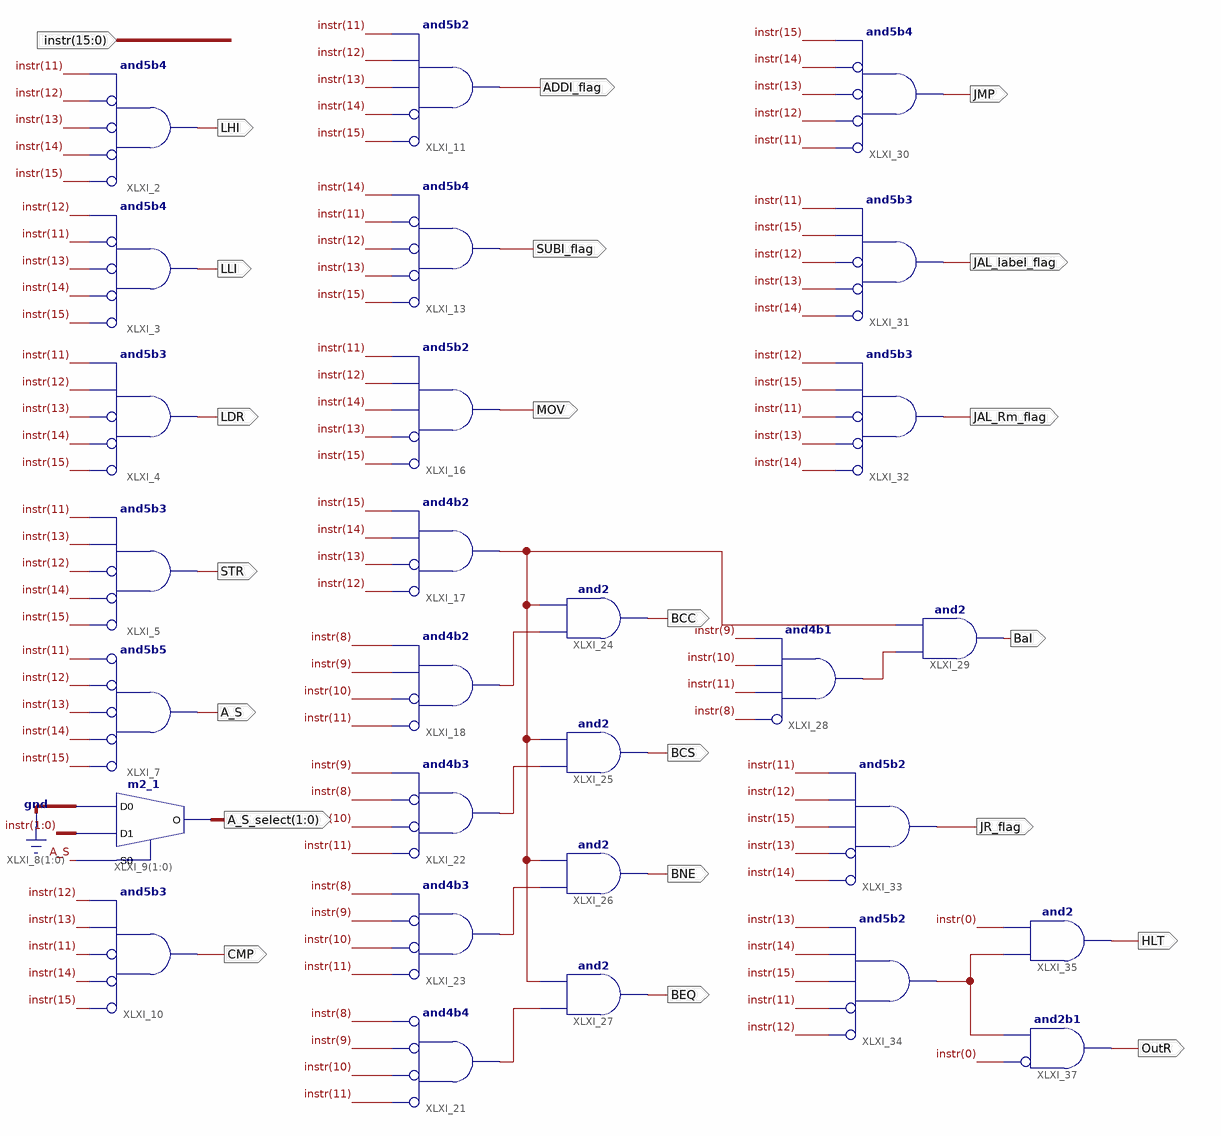
[diagram p0: schematic sheet 1]
// Xilinx ISE schematic ID.sch (artix7) as structural Verilog: 28 symbols, 22 ports
module ID (
  input  [15:0] instr,
  output LHI,
  output LLI,
  output LDR,
  output STR,
  output A_S,
  output [1:0] A_S_select,
  output CMP,
  output ADDI_flag,
  output SUBI_flag,
  output MOV,
  output BCC,
  output BCS,
  output BNE,
  output BEQ,
  output Bal,
  output JMP,
  output JAL_label_flag,
  output JAL_Rm_flag,
  output JR_flag,
  output HLT,
  output OutR
);

  wire XLXN_80, XLXN_98, XLXN_99, XLXN_100, XLXN_101, XLXN_112, XLXN_144;

  and XLXI_2 (LHI, ~instr[15], ~instr[14], ~instr[13], ~instr[12], instr[11]);  // and5b4
  and XLXI_3 (LLI, ~instr[15], ~instr[14], ~instr[13], ~instr[11], instr[12]);  // and5b4
  and XLXI_4 (LDR, ~instr[15], ~instr[14], ~instr[13], instr[12], instr[11]);  // and5b3
  and XLXI_5 (STR, ~instr[15], ~instr[14], ~instr[12], instr[13], instr[11]);  // and5b3
  and XLXI_7 (A_S, ~instr[15], ~instr[14], ~instr[13], ~instr[12], ~instr[11]);  // and5b5
  m2_1 XLXI_9[1:0] (.D0(2'b00), .D1(instr[1:0]), .S0(A_S), .O(A_S_select));
  and XLXI_10 (CMP, ~instr[15], ~instr[14], ~instr[11], instr[13], instr[12]);  // and5b3
  and XLXI_11 (ADDI_flag, ~instr[15], ~instr[14], instr[13], instr[12], instr[11]);  // and5b2
  and XLXI_13 (SUBI_flag, ~instr[15], ~instr[13], ~instr[12], ~instr[11], instr[14]);  // and5b4
  and XLXI_16 (MOV, ~instr[15], ~instr[13], instr[14], instr[12], instr[11]);  // and5b2
  and XLXI_17 (XLXN_80, ~instr[12], ~instr[13], instr[14], instr[15]);  // and4b2
  and XLXI_18 (XLXN_98, ~instr[11], ~instr[10], instr[9], instr[8]);  // and4b2
  and XLXI_21 (XLXN_101, ~instr[11], ~instr[10], ~instr[9], ~instr[8]);  // and4b4
  and XLXI_22 (XLXN_99, ~instr[11], ~instr[10], ~instr[8], instr[9]);  // and4b3
  and XLXI_23 (XLXN_100, ~instr[11], ~instr[10], ~instr[9], instr[8]);  // and4b3
  and XLXI_24 (BCC, XLXN_98, XLXN_80);
  and XLXI_25 (BCS, XLXN_99, XLXN_80);
  and XLXI_26 (BNE, XLXN_100, XLXN_80);
  and XLXI_27 (BEQ, XLXN_101, XLXN_80);
  and XLXI_28 (XLXN_112, ~instr[8], instr[11], instr[10], instr[9]);  // and4b1
  and XLXI_29 (Bal, XLXN_112, XLXN_80);
  and XLXI_30 (JMP, ~instr[11], ~instr[12], ~instr[13], ~instr[14], instr[15]);  // and5b4
  and XLXI_31 (JAL_label_flag, ~instr[14], ~instr[13], ~instr[12], instr[15], instr[11]);  // and5b3
  and XLXI_32 (JAL_Rm_flag, ~instr[14], ~instr[13], ~instr[11], instr[15], instr[12]);  // and5b3
  and XLXI_33 (JR_flag, ~instr[14], ~instr[13], instr[15], instr[12], instr[11]);  // and5b2
  and XLXI_34 (XLXN_144, ~instr[12], ~instr[11], instr[15], instr[14], instr[13]);  // and5b2
  and XLXI_35 (HLT, XLXN_144, instr[0]);
  and XLXI_37 (OutR, ~instr[0], XLXN_144);  // and2b1
endmodule
